# Altium schematic sheet EV75E52A_R3_3-Power.SchDoc: Power
size Tabloid; CompanyName: Microchip Technology Inc.; Organization: Microchip Technology; Address1: 2355 West Chandler Blvd.; Address2: Chandler, AZ  85224; Address4: USA; SheetNumber: 3; SheetTitle: Power; Time: Time
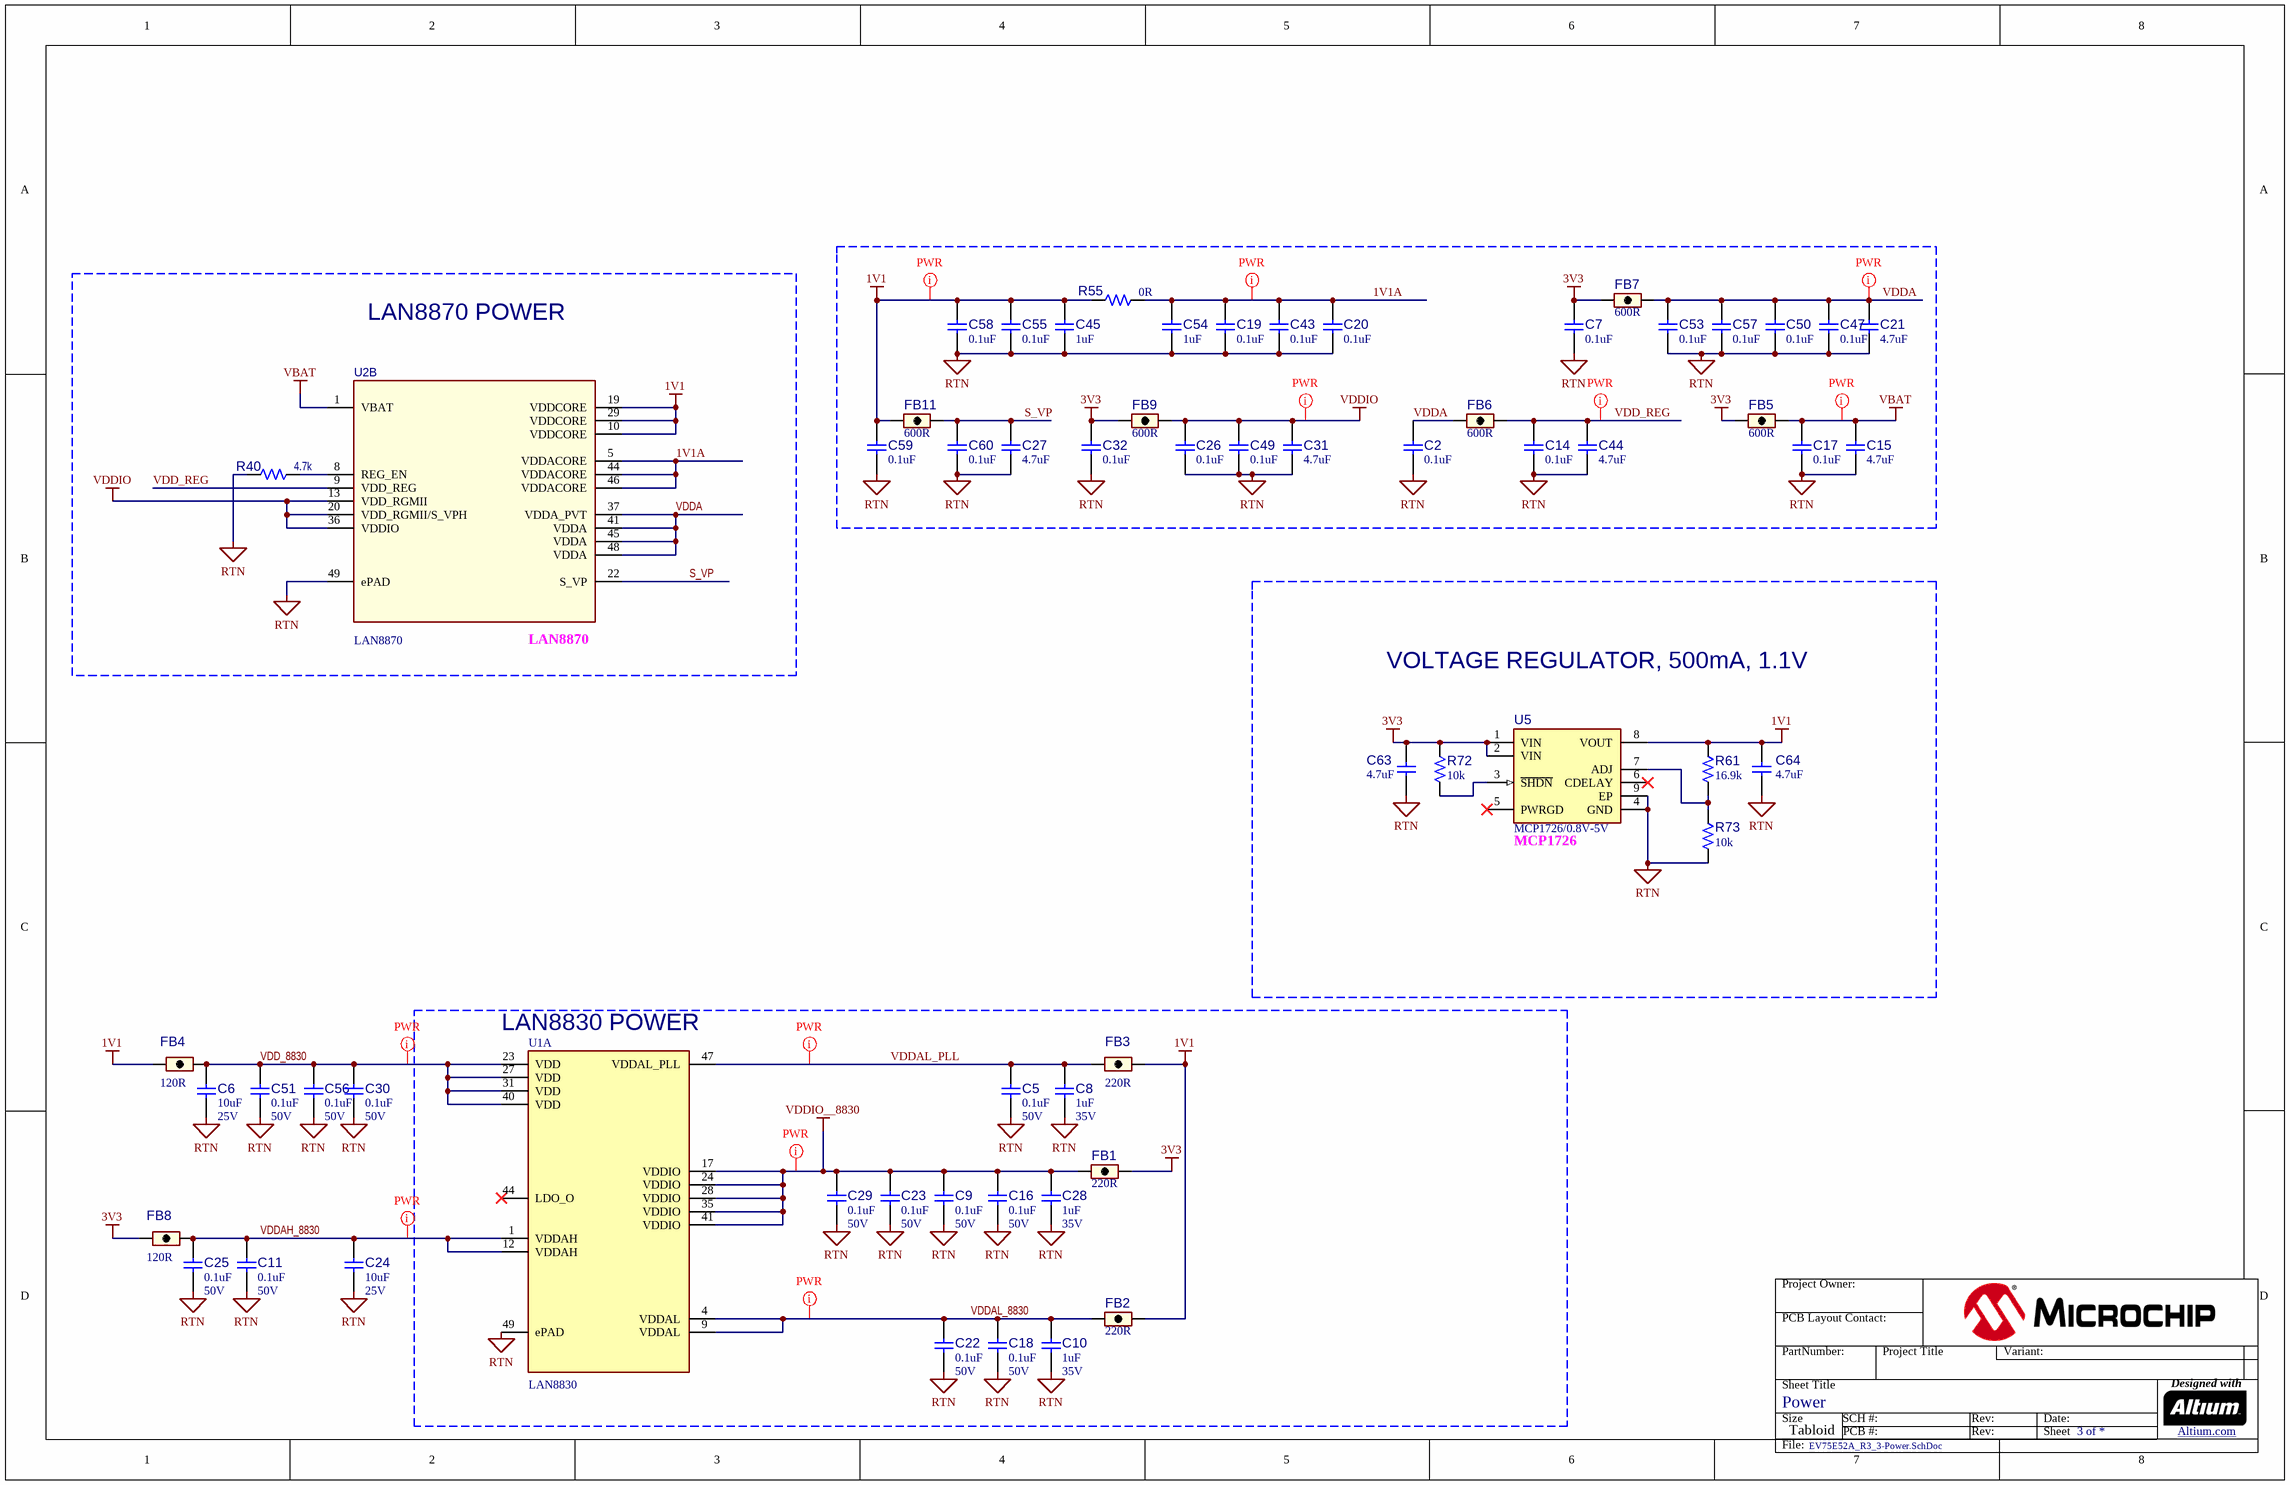
[diagram p0: EV75E52A_R3_3-Power.SchDoc]

## Parts
C2  value 0.1uF  [CAP_C_0402]  (hidden comment: Capacitor NP)
C5  value 0.1uF  Voltage: 50V  [CAP_C_0402]  (hidden comment: Capacitor NP)
C6  value 10uF  Voltage: 25V  [CAP_C_0603]  (hidden comment: Capacitor NP)
C7  value 0.1uF  [CAP_C_0402]  (hidden comment: Capacitor NP)
C8  value 1uF  Voltage: 35V  [CAP_C_0402]  (hidden comment: Capacitor NP)
C9  value 0.1uF  Voltage: 50V  [CAP_C_0402]  (hidden comment: Capacitor NP)
C10  value 1uF  Voltage: 35V  [CAP_C_0402]  (hidden comment: Capacitor NP)
C11  value 0.1uF  Voltage: 50V  [CAP_C_0402]  (hidden comment: Capacitor NP)
C14  value 0.1uF  [CAP_C_0402]  (hidden comment: Capacitor NP)
C15  value 4.7uF  [CAP_C_0402]  (hidden comment: Capacitor NP)
C16  value 0.1uF  Voltage: 50V  [CAP_C_0402]  (hidden comment: Capacitor NP)
C17  value 0.1uF  [CAP_C_0402]  (hidden comment: Capacitor NP)
C18  value 0.1uF  Voltage: 50V  [CAP_C_0402]  (hidden comment: Capacitor NP)
C19  value 0.1uF  [CAP_C_0402]  (hidden comment: Capacitor NP)
C20  value 0.1uF  [CAP_C_0402]  (hidden comment: Capacitor NP)
C21  value 4.7uF  [CAP_C_0402]  (hidden comment: Capacitor NP)
C22  value 0.1uF  Voltage: 50V  [CAP_C_0402]  (hidden comment: Capacitor NP)
C23  value 0.1uF  Voltage: 50V  [CAP_C_0402]  (hidden comment: Capacitor NP)
C24  value 10uF  Voltage: 25V  [CAP_C_0603]  (hidden comment: Capacitor NP)
C25  value 0.1uF  Voltage: 50V  [CAP_C_0402]  (hidden comment: Capacitor NP)
C26  value 0.1uF  [CAP_C_0402]  (hidden comment: Capacitor NP)
C27  value 4.7uF  [CAP_C_0402]  (hidden comment: Capacitor NP)
C28  value 1uF  Voltage: 35V  [CAP_C_0402]  (hidden comment: Capacitor NP)
C29  value 0.1uF  Voltage: 50V  [CAP_C_0402]  (hidden comment: Capacitor NP)
C30  value 0.1uF  Voltage: 50V  [CAP_C_0402]  (hidden comment: Capacitor NP)
C31  value 4.7uF  [CAP_C_0402]  (hidden comment: Capacitor NP)
C32  value 0.1uF  [CAP_C_0402]  (hidden comment: Capacitor NP)
C43  value 0.1uF  [CAP_C_0402]  (hidden comment: Capacitor NP)
C44  value 4.7uF  [CAP_C_0402]  (hidden comment: Capacitor NP)
C45  value 1uF  [CAP_C_0402]  (hidden comment: Capacitor NP)
C47  value 0.1uF  [CAP_C_0402]  (hidden comment: Capacitor NP)
C49  value 0.1uF  [CAP_C_0402]  (hidden comment: Capacitor NP)
C50  value 0.1uF  [CAP_C_0402]  (hidden comment: Capacitor NP)
C51  value 0.1uF  Voltage: 50V  [CAP_C_0402]  (hidden comment: Capacitor NP)
C53  value 0.1uF  [CAP_C_0402]  (hidden comment: Capacitor NP)
C54  value 1uF  [CAP_C_0402]  (hidden comment: Capacitor NP)
C55  value 0.1uF  [CAP_C_0402]  (hidden comment: Capacitor NP)
C56  value 0.1uF  Voltage: 50V  [CAP_C_0402]  (hidden comment: Capacitor NP)
C57  value 0.1uF  [CAP_C_0402]  (hidden comment: Capacitor NP)
C58  value 0.1uF  [CAP_C_0402]  (hidden comment: Capacitor NP)
C59  value 0.1uF  [CAP_C_0402]  (hidden comment: Capacitor NP)
C60  value 0.1uF  [CAP_C_0402]  (hidden comment: Capacitor NP)
C63  value 4.7uF  [CAP_C_0402]  (hidden comment: Capacitor NP)
C64  value 4.7uF  [CAP_C_0402]  (hidden comment: Capacitor NP)
FB1  value 220R  [IND_C_0603]  (hidden comment: Ferrite Bead)
FB2  value 220R  [IND_C_0603]  (hidden comment: Ferrite Bead)
FB3  value 220R  [IND_C_0603]  (hidden comment: Ferrite Bead)
FB4  value 120R  [IND_C_0603]  (hidden comment: Ferrite Bead)
FB5  value 600R  [IND_C_0603]  (hidden comment: Ferrite Bead)
FB6  value 600R  [IND_C_0603]  (hidden comment: Ferrite Bead)
FB7  value 600R  [IND_C_0603]  (hidden comment: Ferrite Bead)
FB8  value 120R  [IND_C_0603]  (hidden comment: Ferrite Bead)
FB9  value 600R  [IND_C_0603]  (hidden comment: Ferrite Bead)
FB11  value 600R  [IND_C_0603]  (hidden comment: Ferrite Bead)
R40  value 4.7k  [RES_C_0402]  (hidden comment: Resistor)
R55  value 0R  [RES_C_0402]  (hidden comment: Resistor)
R61  value 16.9k  [RES_C_0603]  (hidden comment: Resistor)
R72  value 10k  [RES_C_0402]  (hidden comment: Resistor)
R73  value 10k  [RES_C_0603]  (hidden comment: Resistor)
U1  value LAN8830  [QFN-48_7x7_EP5.15x5.15]  (hidden comment: LAN8830 QFN-48)  (part A of 2)
U2  value LAN8870  [QFN-48_7x7_EP5.1x5.1]  (hidden comment: LAN8870 QFN-48)  (part B of 2)
U5  value MCP1726/0.8V-5V  Legend Note: MCP1726  [DFN-8_3x3]  (hidden comment: MCP172X ADJ DFN-8)

## Blocks framed on the sheet
LAN8870 POWER: R40 U2
LAN8830 POWER: C5 C8-C10 C16 C18 C22 C23 C28 C29 FB1-FB3 U1

## Nets
1V1: C45.2 C55.2 C58.2 C59.2 C64.2 FB2.1 FB3.2 FB4.1 FB11.1 R55.1 R61.2 U2.10(VDDCORE) U2.19(VDDCORE) U2.29(VDDCORE) U5.8(VOUT)
3V3: C7.2 C32.2 C63.2 FB1.1 FB5.1 FB7.1 FB8.1 FB9.1 R72.2 U5.1(VIN) U5.2(VIN)
RTN: C2.1 C5.1 C6.1 C7.1 C8.1 C9.1 C10.1 C11.1 C14.1 C15.1 C16.1 C17.1 C18.1 C19.1 C20.1 C21.1 C22.1 C23.1 C24.1 C25.1 C26.1 C27.1 C28.1 C29.1 C30.1 C31.1 C32.1 C43.1 C44.1 C45.1 C47.1 C49.1 C50.1 C51.1 C53.1 C54.1 C55.1 C56.1 C57.1 C58.1 C59.1 C60.1 C63.1 C64.1 R40.2 R73.1 U1.49(ePAD) U2.49(ePAD) U5.4(GND) U5.9(EP)
VBAT: C15.2 C17.2 FB5.2 U2.1(VBAT)
VDDIO: C26.2 C31.2 C49.2 FB9.2 U2.13(VDD_RGMII) U2.20(VDD_RGMII/S_VPH) U2.36(VDDIO)
VDDIO__8830: C9.2 C16.2 C23.2 C28.2 C29.2 FB1.2 U1.17(VDDIO) U1.24(VDDIO) U1.28(VDDIO) U1.35(VDDIO) U1.41(VDDIO)
1V1A: C19.2 C20.2 C43.2 C54.2 R55.2 U2.5(VDDACORE) U2.44(VDDACORE) U2.46(VDDACORE)
S_VP: C27.2 C60.2 FB11.2 U2.22(S_VP)
VDD_8830: C6.2 C30.2 C51.2 C56.2 FB4.2 U1.23(VDD) U1.27(VDD) U1.31(VDD) U1.40(VDD)
VDD_REG: C14.2 C44.2 FB6.2 U2.9(VDD_REG)
VDDA: C2.2 C21.2 C47.2 C50.2 C53.2 C57.2 FB6.1 FB7.2 U2.37(VDDA_PVT) U2.41(VDDA) U2.45(VDDA) U2.48(VDDA)
VDDAH_8830: C11.2 C24.2 C25.2 FB8.2 U1.1(VDDAH) U1.12(VDDAH)
VDDAL_8830: C10.2 C18.2 C22.2 FB2.2 U1.4(VDDAL) U1.9(VDDAL)
VDDAL_PLL: C5.2 C8.2 FB3.1 U1.47(VDDAL_PLL)
NetR40_1: R40.1 U2.8(REG_EN)
NetR61_1: R61.1 R73.2 U5.7(ADJ)
NetR72_1: R72.1 U5.3(~{SHDN})

Not connected (* = marked no-connect by the designer): U1 44(LDO_O)*; U5 5(PWRGD)* 6(CDELAY)*

## Layout directives
net class Power: 1V1, 1V1A, VBAT, VDD_8830, VDD_REG, VDDA, VDDAH_8830, VDDAL_8830, VDDAL_PLL, VDDIO, VDDIO__8830

## Notes on the sheet
- VOLTAGE REGULATOR, 500mA, 1.1V
- Project Owner:
- PCB Layout Contact:
- PartNumber:
- Project Title
- Variant:
- Sheet Title
- Size
- Tabloid
- SCH #:
- PCB #:
- Rev:
- Date:
- Sheet
- Designed with
- Altium.com <http://go.altium.com/MicrochipLandingPage_Evaluation.html>
- File:

## Library data of the parts
C2 C7 C14 C17 C19 C20 C26 C32 C43 C47 C49 C50 C53 C55 C57-C60 = CAP1337: Manufacturer 1: TDK Corporation; Manufacturer Part Number 1: CGA2B3X7R1V104K050BB; Voltage: 35V; Description_: CAP CER 0.1uF 35V 10% X7R SMD 0402; Dev Tools Status: Production; Tolerance: 10%; Type: Ceramic; Owner: Sam Charles; Populated: YES; Temperature Coefficient: X7R; MCHP-ID: CAP1337; Package: 0402; Revision: 1; Symbol: Capacitor NP; Status: MCL Design; ComponentLink1URL: https://chn-vm-apps.microchip.com/mchprepo/parts/Datasheets/mlcc_automotive_general_en.pdf; ComponentLink1Description: SVN Datasheet; ComponentLink2URL: C:\ALTIUM_WORK\00001_MCHP-CDB\Datasheets\mlcc_automotive_general_en.pdf; ComponentLink2Description: Local Datasheet; ComponentLink3URL: C:\ALTIUM_WORK\00001_MCHP-CDB\Library\LibraryRefs\Capacitor NP.SchLib; ComponentLink3Description: Open Symbol; ComponentLink4URL: C:\ALTIUM_WORK\00001_MCHP-CDB\Library\Footprints\CAP_C_0402.PcbLib; ComponentLink4Description: Open Footprint; ComponentLink5Description: Open Footprint 2; ComponentLink6Description: Open Footprint 3; ComponentLink7Description: Open Footprint 4; Operating Temperature: -55C to 125C; Category: Capacitor; Supplier 1: Digi-Key; Supplier Part Number 1: 445-6901-1-ND; Quantity Override: 1
C5 C9 C11 C16 C18 C22 C23 C25 C29 C30 C51 C56 = CAP1463: Capacitor; Manufacturer 1: TDK Corporation; Manufacturer Part Number 1: C1005X7R1H104K050BB; Description_: CAP CER 0.1uF 50V 10% X7R SMD 0402; Dev Tools Status: Production; Tolerance: 10%; Temperature Coeffcient: X7R; Type: Ceramic; Owner: Jamus Griego; Populated: YES; MCHP-ID: CAP1463; Package: 0402; Revision: 1; Symbol: Capacitor NP; Status: MCL Design; ComponentLink1URL: https://chn-vm-apps.microchip.com/mchprepo/parts/Datasheets/TDKMLCCCapRange.pdf; ComponentLink1Description: SVN Datasheet; ComponentLink2URL: C:\ALTIUM_WORK\00001_MCHP-CDB\Datasheets\TDKMLCCCapRange.pdf; ComponentLink2Description: Local Datasheet; ComponentLink3URL: C:\ALTIUM_WORK\00001_MCHP-CDB\Library\LibraryRefs\Capacitor NP.SchLib; ComponentLink3Description: Open Symbol; ComponentLink4URL: C:\ALTIUM_WORK\00001_MCHP-CDB\Library\Footprints\CAP_C_0402.PcbLib; ComponentLink4Description: Open Footprint; ComponentLink5Description: Open Footprint 2; ComponentLink6Description: Open Footprint 3; ComponentLink7Description: Open Footprint 4; Operating Temperature: -55C to +125C; Category: Capacitor; Supplier 1: Digi-Key; Supplier Part Number 1: 445-5932-1-ND; Quantity Override: 1
C6 C24 = CAP1461: Capacitor; Manufacturer 1: Murata Electronics North America; Manufacturer Part Number 1: GRM188R61E106MA73D; Description_: CAP CER 10UF 25V 20% X5R SMD 0603; Dev Tools Status: Production; Tolerance: ±20%; Temperature Coeffcient: X5R; Type: Ceramic; Owner: Tim Moffat; Populated: YES; MCHP-ID: CAP1461; Package: 0603; Revision: 1; Symbol: Capacitor NP; Status: MCL Design; ComponentLink1URL: https://chn-vm-apps.microchip.com/mchprepo/parts/Datasheets/GRM188R61E106MA73-01.pdf; ComponentLink1Description: SVN Datasheet; ComponentLink2URL: C:\ALTIUM_WORK\00001_MCHP-CDB\Datasheets\GRM188R61E106MA73-01.pdf; ComponentLink2Description: Local Datasheet; ComponentLink3URL: C:\ALTIUM_WORK\00001_MCHP-CDB\Library\LibraryRefs\Capacitor NP.SchLib; ComponentLink3Description: Open Symbol; ComponentLink4URL: C:\ALTIUM_WORK\00001_MCHP-CDB\Library\Footprints\CAP_C_0603.PcbLib; ComponentLink4Description: Open Footprint; ComponentLink5Description: Open Footprint 2; ComponentLink6Description: Open Footprint 3; ComponentLink7Description: Open Footprint 4; Operating Temperature: -55C to 85C; Category: Capacitor; Supplier 1: Digi-Key; Supplier Part Number 1: 490-7202-1-ND; Quantity Override: 1
C8 C10 C28 = CAP1338: Capacitor; Manufacturer 1: Murata Electronics North America; Manufacturer Part Number 1: GRM155R6YA105KE11D; Description_: CAP CER 1uF 35V 10% X5R SMD 0402; Dev Tools Status: Design; Tolerance: 10%; Temperature Coeffcient: X5R; Type: Ceramic; Owner: Sam Charles; Populated: YES; MCHP-ID: CAP1338; Package: 0402; Revision: A; Symbol: Capacitor NP; Status: MCL Design; ComponentLink1URL: https://chn-vm-apps.microchip.com/mchprepo/parts/Datasheets/c02e.pdf; ComponentLink1Description: SVN Datasheet; ComponentLink2URL: C:\ALTIUM_WORK\00001_MCHP-CDB\Datasheets\c02e.pdf; ComponentLink2Description: Local Datasheet; ComponentLink3URL: C:\ALTIUM_WORK\00001_MCHP-CDB\Library\LibraryRefs\Capacitor NP.SchLib; ComponentLink3Description: Open Symbol; ComponentLink4URL: C:\ALTIUM_WORK\00001_MCHP-CDB\Library\Footprints\CAP_C_0402.PcbLib; ComponentLink4Description: Open Footprint; ComponentLink5Description: Open Footprint 2; ComponentLink6Description: Open Footprint 3; ComponentLink7Description: Open Footprint 4; Operating Temperature: -55C to +85C; Category: Capacitor; Supplier 1: Digi-Key; Supplier Part Number 1: 490-10019-1-ND; Quantity Override: 1
C15 C21 C27 C31 C44 C63 C64 = CAP1207: Manufacturer 1: Murata; Manufacturer Part Number 1: GRM155R60J475ME47D; Voltage: 6.3V; Description_: CAP CER 4.7uF 6.3V 20% X5R SMD 0402; Dev Tools Status: Production; Tolerance: 20%; Temperature Coefficient: X5R; Type: Ceramic; Owner: Tad Ahlvers; Populated: YES; MCHP-ID: CAP1207; Package: 0402; Revision: 1; Symbol: Capacitor NP; Status: MCL Design; ComponentLink1URL: https://chn-vm-apps.microchip.com/mchprepo/parts/Datasheets/c02e.pdf; ComponentLink1Description: SVN Datasheet; ComponentLink2URL: C:\ALTIUM_WORK\00001_MCHP-CDB\Datasheets\c02e.pdf; ComponentLink2Description: Local Datasheet; ComponentLink3URL: C:\ALTIUM_WORK\00001_MCHP-CDB\Library\LibraryRefs\Capacitor NP.SchLib; ComponentLink3Description: Open Symbol; ComponentLink4URL: C:\ALTIUM_WORK\00001_MCHP-CDB\Library\Footprints\CAP_C_0402.PcbLib; ComponentLink4Description: Open Footprint; ComponentLink5Description: Open Footprint 2; ComponentLink6Description: Open Footprint 3; ComponentLink7Description: Open Footprint 4; Operating Temperature: -55C to +85C; Category: Capacitor; Manufacturer 2: TDK Corporation; Manufacturer Part Number 2: C1005X5R0J475M050BC; Supplier 1: Digi-Key; Supplier Part Number 1: 490-5915-2-ND; Supplier 2: Digi-Key; Supplier Part Number 2: 445-7395-2-ND; Quantity Override: 1
C45 C54 = CAP1338: Manufacturer 1: Murata Electronics North America; Manufacturer Part Number 1: GRM155R6YA105KE11D; Voltage: 35V; Description_: CAP CER 1uF 35V 10% X5R SMD 0402; Dev Tools Status: Production; Tolerance: 10%; Type: Ceramic; Owner: Sam Charles; Populated: YES; Temperature Coefficient: X5R; MCHP-ID: CAP1338; Package: 0402; Revision: 1; Symbol: Capacitor NP; Status: MCL Design; ComponentLink1URL: https://chn-vm-apps.microchip.com/mchprepo/parts/Datasheets/c02e.pdf; ComponentLink1Description: SVN Datasheet; ComponentLink2URL: C:\ALTIUM_WORK\00001_MCHP-CDB\Datasheets\c02e.pdf; ComponentLink2Description: Local Datasheet; ComponentLink3URL: C:\ALTIUM_WORK\00001_MCHP-CDB\Library\LibraryRefs\Capacitor NP.SchLib; ComponentLink3Description: Open Symbol; ComponentLink4URL: C:\ALTIUM_WORK\00001_MCHP-CDB\Library\Footprints\CAP_C_0402.PcbLib; ComponentLink4Description: Open Footprint; ComponentLink5Description: Open Footprint 2; ComponentLink6Description: Open Footprint 3; ComponentLink7Description: Open Footprint 4; Operating Temperature: -55C to +85C; Category: Capacitor; Supplier 1: Digi-Key; Supplier Part Number 1: 490-10019-1-ND; Quantity Override: 1
FB1 FB2 = IND1312: FERRITE 180R 1.5A SMD 0603; Manufacturer 1: Murata Electronics North America; Manufacturer Part Number 1: BLM18EG221SN1D; Description_: FERRITE 220R@100MHZ 2A SMD 0603; Dev Tools Status: Design; Owner: Sam Charles; DCR: 0.050R; Test Frequency: 100Mhz; Populated: Yes; MCHP-ID: IND1312; Revision: A; Symbol: Ferrite Bead; Status: MCL Design; ComponentLink1URL: https://chn-vm-apps.microchip.com/mchprepo/parts/Datasheets/L0110S0101BLM18E.pdf; ComponentLink1Description: SVN Datasheet; ComponentLink2URL: C:\ALTIUM_WORK\00001_MCHP-CDB\Datasheets\L0110S0101BLM18E.pdf; ComponentLink2Description: Local Datasheet; ComponentLink3URL: C:\ALTIUM_WORK\00001_MCHP-CDB\Library\LibraryRefs\Ferrite Bead.SchLib; ComponentLink3Description: Open Symbol; ComponentLink4URL: C:\ALTIUM_WORK\00001_MCHP-CDB\Library\Footprints\IND_C_0603.PcbLib; ComponentLink4Description: Open Footprint; ComponentLink5Description: Open Footprint 2; ComponentLink6Description: Open Footprint 3; ComponentLink7Description: Open Footprint 4; Operating Temperature: -55°C ~ 125°C; Package: 0603; Type: Ferrite Bead; Category: Inductor; Manufacturer 2: MOUSER ELECTRONICS; Manufacturer Part Number 2: 81-BLM18EG221SN1D; Supplier 1: Digi-Key; Supplier Part Number 1: 490-3992-6-ND; Supplier 2: MOUSER ELECTRONICS; Supplier Part Number 2: 81-BLM18EG221SN1D; Quantity Override: 1
FB3 = IND1312: Manufacturer 1: D1_Murata Electronics North America; Manufacturer Part Number 1: BLM18EG221SN1D; Description_: FERRITE 220R@100MHZ 2A SMD 0603; Dev Tools Status: Production; Owner: Sam Charles; DCR: 0.050R; Test Frequency: 100Mhz; Populated: YES; MCHP-ID: IND1312; Revision: 2; Symbol: Ferrite Bead; Status: MCL Design; ComponentLink1URL: https://chn-vm-apps.microchip.com/mchprepo/parts/Datasheets/L0110S0101BLM18E.pdf; ComponentLink1Description: SVN Datasheet; ComponentLink2URL: C:\ALTIUM_WORK\00001_MCHP-CDB\Datasheets\L0110S0101BLM18E.pdf; ComponentLink2Description: Local Datasheet; ComponentLink3URL: C:\ALTIUM_WORK\00001_MCHP-CDB\Library\LibraryRefs\Ferrite Bead.SchLib; ComponentLink3Description: Open Symbol; ComponentLink4URL: C:\ALTIUM_WORK\00001_MCHP-CDB\Library\Footprints\IND_C_0603.PcbLib; ComponentLink4Description: Open Footprint; ComponentLink5Description: Open Footprint 2; ComponentLink6Description: Open Footprint 3; ComponentLink7Description: Open Footprint 4; Operating Temperature: -55°C ~ 125°C; Package: 0603; Type: Ferrite Bead; Category: Inductor; Manufacturer 2: Mouser; Manufacturer Part Number 2: 81-BLM18EG221SN1D; Supplier 1: Digi-Key; Supplier Part Number 1: 490-3992-6-ND; Supplier 2: Mouser; Supplier Part Number 2: 81-BLM18EG221SN1D; Quantity Override: 1
FB4 FB8 = FB1003: FERRITE 180R 1.5A SMD 0603; Manufacturer 1: TDK Corporation; Manufacturer Part Number 1: MMZ1608B121CTAH0; MCHP-ID: FB1003; Description_: FERRITE 600mA 120R SMD 0603; Dev Tools Status: Production; Owner: Jamus Griego; Populated: YES; Revision: 1; Symbol: Ferrite Bead; Status: MCL Design; ComponentLink1URL: https://chn-vm-apps.microchip.com/mchprepo/parts/Datasheets/beads_commercial_signal_mmz1608_en.pdf; ComponentLink1Description: SVN Datasheet; ComponentLink2URL: C:\ALTIUM_WORK\00001_MCHP-CDB\Datasheets\beads_commercial_signal_mmz1608_en.pdf; ComponentLink2Description: Local Datasheet; ComponentLink3URL: C:\ALTIUM_WORK\00001_MCHP-CDB\Library\LibraryRefs\Ferrite Bead.SchLib; ComponentLink3Description: Open Symbol; ComponentLink4URL: C:\ALTIUM_WORK\00001_MCHP-CDB\Library\Footprints\IND_C_0603.PcbLib; ComponentLink4Description: Open Footprint; ComponentLink5Description: Open Footprint 2; ComponentLink6Description: Open Footprint 3; ComponentLink7Description: Open Footprint 4; Type: Ferrite Bead; Category: Inductor; Supplier 1: Digi-Key; Supplier Part Number 1: 445-2164-1-ND; Quantity Override: 1
FB5 FB7 FB9 FB11 = IND1598: Manufacturer 1: Murata Electronics North America; Manufacturer Part Number 1: BLM18AG601SH1D; Description_: FERRITE 600R 500mA SMD 0603; Dev Tools Status: Design; Owner: Sam Charles; DCR: 0.380R; Test Frequency: 100MHz; Populated: YES; MCHP-ID: IND1598; Revision: A; Symbol: Ferrite Bead; Status: MCL Design; ComponentLink1URL: https://chn-vm-apps.microchip.com/mchprepo/parts/Datasheets/QNFA9101.pdf; ComponentLink1Description: SVN Datasheet; ComponentLink2URL: C:\ALTIUM_WORK\00001_MCHP-CDB\Datasheets\QNFA9101.pdf; ComponentLink2Description: Local Datasheet; ComponentLink3URL: C:\ALTIUM_WORK\00001_MCHP-CDB\Library\LibraryRefs\Ferrite Bead.SchLib; ComponentLink3Description: Open Symbol; ComponentLink4URL: C:\ALTIUM_WORK\00001_MCHP-CDB\Library\Footprints\IND_C_0603.PcbLib; ComponentLink4Description: Open Footprint; ComponentLink5Description: Open Footprint 2; ComponentLink6Description: Open Footprint 3; ComponentLink7Description: Open Footprint 4; Operating Temperature: -55°C ~ 125°C; Package: 0603; Type: Ferrite Bead; Category: Inductor; Supplier 1: Digi-Key; Supplier Part Number 1: 490-7811-1-ND; Quantity Override: 1
FB6 = IND1598: Manufacturer 1: Murata Electronics North America; Manufacturer Part Number 1: BLM18AG601SH1D; Description_: FERRITE 600R 500mA SMD 0603; Dev Tools Status: Design; Owner: Sam Charles; DCR: 0.380R; Test Frequency: 100MHz; Populated: Yes; MCHP-ID: IND1598; Revision: A; Symbol: Ferrite Bead; Status: MCL Design; ComponentLink1URL: https://chn-vm-apps.microchip.com/mchprepo/parts/Datasheets/QNFA9101.pdf; ComponentLink1Description: SVN Datasheet; ComponentLink2URL: C:\ALTIUM_WORK\00001_MCHP-CDB\Datasheets\QNFA9101.pdf; ComponentLink2Description: Local Datasheet; ComponentLink3URL: C:\ALTIUM_WORK\00001_MCHP-CDB\Library\LibraryRefs\Ferrite Bead.SchLib; ComponentLink3Description: Open Symbol; ComponentLink4URL: C:\ALTIUM_WORK\00001_MCHP-CDB\Library\Footprints\IND_C_0603.PcbLib; ComponentLink4Description: Open Footprint; ComponentLink5Description: Open Footprint 2; ComponentLink6Description: Open Footprint 3; ComponentLink7Description: Open Footprint 4; Operating Temperature: -55°C ~ 125°C; Package: 0603; Type: Ferrite Bead; Category: Inductor; Supplier 1: Digi-Key; Supplier Part Number 1: 490-7811-1-ND; Quantity Override: 1
R40 = RES1813: Manufacturer 1: Yageo; Manufacturer Part Number 1: RC0402FR-074K7L; Tolerance: 1%; Description_: RES TKF 4.7k 1% 1/16W SMD 0402; Dev Tools Status: Production; Temperature Coeffcient: 100ppm/C; Circuit Type: Isolated; Power: 1/16W; Owner: Mike Ragsdale; Populated: YES; MCHP-ID: RES1813; Package: 0402; Revision: 1; Symbol: resistor; Status: MCL Design; ComponentLink1URL: https://chn-vm-apps.microchip.com/mchprepo/parts/Datasheets/PYu-RC_Group_51_RoHS_L_8.pdf; ComponentLink1Description: SVN Datasheet; ComponentLink2URL: C:\ALTIUM_WORK\00001_MCHP-CDB\Datasheets\PYu-RC_Group_51_RoHS_L_8.pdf; ComponentLink2Description: Local Datasheet; ComponentLink3URL: C:\ALTIUM_WORK\00001_MCHP-CDB\Library\LibraryRefs\resistor.SchLib; ComponentLink3Description: Open Symbol; ComponentLink4URL: C:\ALTIUM_WORK\00001_MCHP-CDB\Library\Footprints\RES_C_0402.PcbLib; ComponentLink4Description: Open Footprint; ComponentLink5Description: Open Footprint 2; ComponentLink6Description: Open Footprint 3; ComponentLink7Description: Open Footprint 4; Operating Temperature: -55C to +155C; Category: Resistor; Type: RES SMD; Supplier 1: Digi-Key; Supplier Part Number 1: 311-4.7KLRTR-ND; Supplier 2: Digi-Key; Supplier Part Number 2: 311-4.7KLRCT-ND; Quantity Override: 1
R55 = RSMT0730: Manufacturer 1: Panasonic; Manufacturer Part Number 1: ERJ-2GE0R00X; Description_: RES TKF 0R SMD 0402 AEC-Q200; Dev Tools Status: Production; Populated: YES; MCHP-ID: RSMT0730; Package: 0402; Revision: 2; Symbol: Resistor; Status: MCL Design; ComponentLink1URL: https://chn-vm-apps.microchip.com/mchprepo/parts/Datasheets/AOA0000CE1.pdf; ComponentLink1Description: SVN Datasheet; ComponentLink2URL: C:\ALTIUM_WORK\00001_MCHP-CDB\Datasheets\AOA0000CE1.pdf; ComponentLink2Description: Local Datasheet; ComponentLink3URL: C:\ALTIUM_WORK\00001_MCHP-CDB\Library\LibraryRefs\Resistor.SchLib; ComponentLink3Description: Open Symbol; ComponentLink4URL: C:\ALTIUM_WORK\00001_MCHP-CDB\Library\Footprints\RES_C_0402.PcbLib; ComponentLink4Description: Open Footprint; ComponentLink5Description: Open Footprint 2; ComponentLink6Description: Open Footprint 3; ComponentLink7Description: Open Footprint 4; Operating Temperature: -55C to +155C; Category: Resistor; Type: RES SMD; Composition: TKF; Manufacturer 2: Vishay; Manufacturer Part Number 2: CRCW04020000Z0ED; Supplier 1: digikey; Supplier Part Number 1: P0.0JCT-ND; Supplier 2: digikey; Supplier Part Number 2: 541-0.0JTR-ND; Quantity Override: 1
R61 = RSMT1275: Manufacturer 1: Stackpole Electronics Inc; Manufacturer Part Number 1: RMCF0603FT16K9; Tolerance: 1%; Description_: RES TKF 16.9k 1% 1/10W SMD 0603 AEC-Q200; Dev Tools Status: Production; Voltage: 75V; Temperature Coefficient: 100ppm/C; Current: 1A; Power: 1/10W; Owner: Alexandru Chiser; Populated: YES; MCHP-ID: RSMT1275; Package: 0603; Revision: 1; Symbol: Resistor; Status: MCL Design; ComponentLink1URL: https://chn-vm-apps.microchip.com/mchprepo/parts/Datasheets/sei-rmcf_rmcp.pdf; ComponentLink1Description: SVN Datasheet; ComponentLink2URL: C:\ALTIUM_WORK\00001_MCHP-CDB\Datasheets\sei-rmcf_rmcp.pdf; ComponentLink2Description: Local Datasheet; ComponentLink3URL: C:\ALTIUM_WORK\00001_MCHP-CDB\Library\LibraryRefs\Resistor.SchLib; ComponentLink3Description: Open Symbol; ComponentLink4URL: C:\ALTIUM_WORK\00001_MCHP-CDB\Library\Footprints\RES_C_0603.PcbLib; ComponentLink4Description: Open Footprint; ComponentLink5Description: Open Footprint 2; ComponentLink6Description: Open Footprint 3; ComponentLink7Description: Open Footprint 4; Operating Temperature: -55C to +155C; Category: Resistor; Type: RES SMD; Composition: TKF; Supplier 1: Digi-Key; Supplier Part Number 1: RMCF0603FT16K9CT-ND; Quantity Override: 1
R72 = RSMT1019: Manufacturer 1: Panasonic; Manufacturer Part Number 1: ERJ-2RKF1002X; Tolerance: 1%; Description_: RES TKF 10k 1% 1/10W SMD 0402; Dev Tools Status: Production; Voltage: 50V; Power: 1/10W; Owner: Brent Lanphear; Populated: Yes; Temperature Coefficient: 100ppm/C; MCHP-ID: RSMT1019; Package: 0402; Revision: 2; Symbol: Resistor; Status: MCL Design; ComponentLink1URL: https://chn-vm-apps.microchip.com/mchprepo/parts/Datasheets/AOA0000CE2.pdf; ComponentLink1Description: SVN Datasheet; ComponentLink2URL: C:\ALTIUM_WORK\00001_MCHP-CDB\Datasheets\AOA0000CE2.pdf; ComponentLink2Description: Local Datasheet; ComponentLink3URL: C:\ALTIUM_WORK\00001_MCHP-CDB\Library\LibraryRefs\Resistor.SchLib; ComponentLink3Description: Open Symbol; ComponentLink4URL: C:\ALTIUM_WORK\00001_MCHP-CDB\Library\Footprints\RES_C_0402.PcbLib; ComponentLink4Description: Open Footprint; ComponentLink5Description: Open Footprint 2; ComponentLink6Description: Open Footprint 3; ComponentLink7Description: Open Footprint 4; Operating Temperature: -55C to +155C; Category: Resistor; Type: RES SMD; Composition: TKF; Quantity Override: 1; Supplier 1: Digi-Key; Supplier Part Number 1: P10.0KLCT-ND; Supplier 2: Mouser; Supplier Part Number 2: 667-ERJ-2RKF1002X
R73 = RES1368: Manufacturer 1: TE Connectivity Passive Product; Manufacturer Part Number 1: CPF0603F10KC1; Tolerance: 1%; Description_: RES TF 10k 1% 1/16W SMD 0603; Dev Tools Status: Production; Voltage: 100V; Temperature Coefficient: 50ppm/C; Circuit Type: Isolated; Power: 1/16W; Owner: Jairuz Agang-ang; Populated: YES; MCHP-ID: RES1368; Package: 0603; Revision: 1; Symbol: Resistor; Status: MCL Design; ComponentLink1URL: https://chn-vm-apps.microchip.com/mchprepo/parts/Datasheets/ENG_DS_1773200_H.pdf; ComponentLink1Description: SVN Datasheet; ComponentLink2URL: C:\ALTIUM_WORK\00001_MCHP-CDB\Datasheets\ENG_DS_1773200_H.pdf; ComponentLink2Description: Local Datasheet; ComponentLink3URL: C:\ALTIUM_WORK\00001_MCHP-CDB\Library\LibraryRefs\Resistor.SchLib; ComponentLink3Description: Open Symbol; ComponentLink4URL: C:\ALTIUM_WORK\00001_MCHP-CDB\Library\Footprints\RES_C_0603.PcbLib; ComponentLink4Description: Open Footprint; ComponentLink5Description: Open Footprint 2; ComponentLink6Description: Open Footprint 3; ComponentLink7Description: Open Footprint 4; Operating Temperature: -55C to +155C; Category: Resistor; Type: RES SMD; Composition: TF; Supplier 1: Digi-Key; Supplier Part Number 1: A102203CT-ND; Quantity Override: 1
U1 = MIC9630: Manufacturer 1: Microchip Technology; Manufacturer Part Number 1: LAN8830/PSA; Description_: MCHP INTERFACE ETHERNET LAN8830 QFN-48; Dev Tools Status: Design; Owner: Sam Charles; Populated: YES; MCHP-ID: MIC9630; Symbol: LAN8830 QFN-48; Type: Ethernet; Status: MCL Design; Revision: 1; Category: MCHP-Interface; ComponentLink1URL: https://chn-vm-apps.microchip.com/mchprepo/parts/Datasheets/LAN8830 Prelimin Datasheet RevA; ComponentLink1Description: SVN Datasheet; ComponentLink2URL: C:\ALTIUM_WORK\00001_MCHP-CDB\Datasheets\LAN8830 Prelimin Datasheet RevA; ComponentLink2Description: Local Datasheet; ComponentLink3URL: C:\ALTIUM_WORK\00001_MCHP-CDB\Library\LibraryRefs\LAN8830 QFN-48.SchLib; ComponentLink3Description: Open Symbol; ComponentLink4URL: C:\ALTIUM_WORK\00001_MCHP-CDB\Library\Footprints\QFN-48_7x7_EP5.15x5.15.PcbLib; ComponentLink4Description: Open Footprint; ComponentLink5Description: Open Footprint 2; ComponentLink6Description: Open Footprint 3; ComponentLink7Description: Open Footprint 4; Supplier 1: Microchip Technology; Supplier Part Number 1: LAN8830/PSA; Operating Temperature: 0°C ~ 70°C; Quantity Override: 1
U2 = LAN8870 QFN-48: Manufacturer 1: Microchip Technology; Manufacturer Part Number 1: LAN8870-V/PUAVAO; MCHP-ID: MIC9579; Description_: MCHP INTERFACE LAN8870 1000BASE-T1 TRANSCEIVER; Dev Tools Status: Production; Owner: Sam Charles; Populated: YES; Revision: 1; ComponentLink1Description: SVN Datasheet; ComponentLink2Description: Local Datasheet; ComponentLink5Description: Open Footprint 2; ComponentLink6Description: Open Footprint 3; ComponentLink7Description: Open Footprint 4; Symbol: LAN8870 QFN-48; Type: Ethernet; Status: MCL Design; Category: MCHP-Interface; Supplier 1: Microchip Technology; Supplier Part Number 1: LAN8870-V/PUAVAO; Operating Temperature: -40C to +105C; Quantity Override: 1; BOM Notes: *; Legend Note: LAN8870
U5 = MIC2616: LDO ADJ; Manufacturer 1: Microchip; Manufacturer Part Number 1: MCP1726T-ADJE/MF; Description_: MCHP ANALOG LDO 0.8V-5V MCP1726T-ADJE/MF DFN-8; Dev Tools Status: Production; Populated: Yes; MCHP-ID: MIC2616; Symbol: MCP172X ADJ DFN-8; Type: LDO; Status: MCL Design; Revision: 0; Category: MCHP-Analog; ComponentLink1URL: https://www.microchip.com/sitesearch/search/Product%20and%20Development%20Tools/MCP1726T-ADJE/MF; ComponentLink1Description: SVN Datasheet; ComponentLink2Description: Local Datasheet; ComponentLink3URL: C:\ALTIUM_WORK\00001_MCHP-CDB\Library\LibraryRefs\MCP172X ADJ DFN-8.SchLib; ComponentLink3Description: Open Symbol; ComponentLink4URL: C:\ALTIUM_WORK\00001_MCHP-CDB\Library\Footprints\DFN-8_3x3.PcbLib; ComponentLink4Description: Open Footprint; ComponentLink5Description: Open Footprint 2; ComponentLink6Description: Open Footprint 3; ComponentLink7Description: Open Footprint 4; Manufacturer 2: Microchip; Manufacturer Part Number 2: MCP1726-ADJE/MF; Supplier 1: Microchip; Supplier Part Number 1: MCP1726T-ADJE/MF; Supplier 2: Microchip; Supplier Part Number 2: MCP1726-ADJE/MF; Operating Temperature: -40C to +125C; Quantity Override: 1